# Altium schematic sheet GPIO_M1.SchDoc
size A4
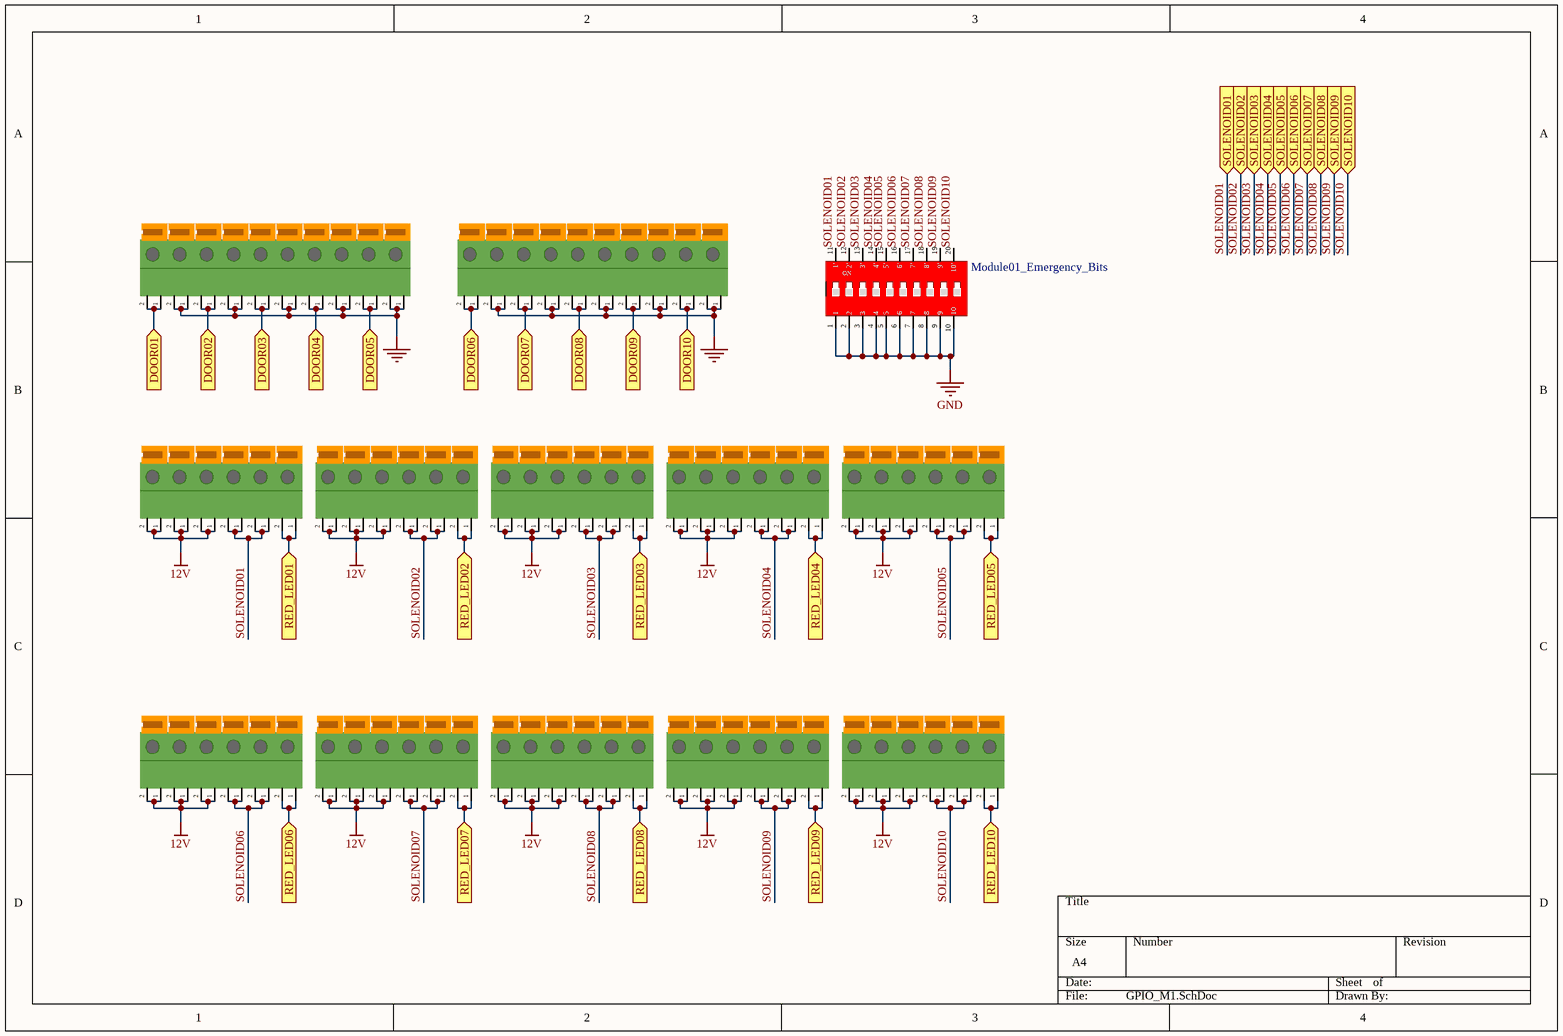
[diagram p0: GPIO_M1.SchDoc]

## Parts
*1  D01  [5#Terminalx1]  (value not drawn)
*2  D06  [5#Terminalx1]  (value not drawn)
*3  GND  [5#Terminalx1]  (value not drawn)
*4  GND  [5#Terminalx1]  (value not drawn)
*5  D02  [5#Terminalx1]  (value not drawn)
*6  D07  [5#Terminalx1]  (value not drawn)
*7  GND  [5#Terminalx1]  (value not drawn)
*8  GND  [5#Terminalx1]  (value not drawn)
*9  D03  [5#Terminalx1]  (value not drawn)
*10  D08  [5#Terminalx1]  (value not drawn)
*11  GND  [5#Terminalx1]  (value not drawn)
*12  GND  [5#Terminalx1]  (value not drawn)
*13  D04  [5#Terminalx1]  (value not drawn)
*14  D09  [5#Terminalx1]  (value not drawn)
*15  GND  [5#Terminalx1]  (value not drawn)
*16  GND  [5#Terminalx1]  (value not drawn)
*17  D05  [5#Terminalx1]  (value not drawn)
*18  D10  [5#Terminalx1]  (value not drawn)
*19  GND  [5#Terminalx1]  (value not drawn)
*20  GND  [5#Terminalx1]  (value not drawn)
*21  12V  [5#Terminalx1]  (value not drawn)
*22  12V  [5#Terminalx1]  (value not drawn)
*23  12V  [5#Terminalx1]  (value not drawn)
*24  12V  [5#Terminalx1]  (value not drawn)
*25  12V  [5#Terminalx1]  (value not drawn)
*26  12V  [5#Terminalx1]  (value not drawn)
*27  S01  [5#Terminalx1]  (value not drawn)
*28  S06  [5#Terminalx1]  (value not drawn)
*29  G01  [5#Terminalx1]  (value not drawn)
*30  G06  [5#Terminalx1]  (value not drawn)
*31  R01  [5#Terminalx1]  (value not drawn)
*32  R06  [5#Terminalx1]  (value not drawn)
*33  12V  [5#Terminalx1]  (value not drawn)
*34  12V  [5#Terminalx1]  (value not drawn)
*35  12V  [5#Terminalx1]  (value not drawn)
*36  12V  [5#Terminalx1]  (value not drawn)
*37  12V  [5#Terminalx1]  (value not drawn)
*38  12V  [5#Terminalx1]  (value not drawn)
*39  S02  [5#Terminalx1]  (value not drawn)
*40  S07  [5#Terminalx1]  (value not drawn)
*41  G02  [5#Terminalx1]  (value not drawn)
*42  G07  [5#Terminalx1]  (value not drawn)
*43  R02  [5#Terminalx1]  (value not drawn)
*44  R07  [5#Terminalx1]  (value not drawn)
*45  12V  [5#Terminalx1]  (value not drawn)
*46  12V  [5#Terminalx1]  (value not drawn)
*47  12V  [5#Terminalx1]  (value not drawn)
*48  12V  [5#Terminalx1]  (value not drawn)
*49  12V  [5#Terminalx1]  (value not drawn)
*50  12V  [5#Terminalx1]  (value not drawn)
*51  S03  [5#Terminalx1]  (value not drawn)
*52  S08  [5#Terminalx1]  (value not drawn)
*53  G03  [5#Terminalx1]  (value not drawn)
*54  G08  [5#Terminalx1]  (value not drawn)
*55  R03  [5#Terminalx1]  (value not drawn)
*56  R08  [5#Terminalx1]  (value not drawn)
*57  12V  [5#Terminalx1]  (value not drawn)
*58  12V  [5#Terminalx1]  (value not drawn)
*59  12V  [5#Terminalx1]  (value not drawn)
*60  12V  [5#Terminalx1]  (value not drawn)
*61  12V  [5#Terminalx1]  (value not drawn)
*62  12V  [5#Terminalx1]  (value not drawn)
*63  S04  [5#Terminalx1]  (value not drawn)
*64  S09  [5#Terminalx1]  (value not drawn)
*65  G04  [5#Terminalx1]  (value not drawn)
*66  G09  [5#Terminalx1]  (value not drawn)
*67  R04  [5#Terminalx1]  (value not drawn)
*68  R09  [5#Terminalx1]  (value not drawn)
*69  12V  [5#Terminalx1]  (value not drawn)
*70  12V  [5#Terminalx1]  (value not drawn)
*71  12V  [5#Terminalx1]  (value not drawn)
*72  12V  [5#Terminalx1]  (value not drawn)
*73  12V  [5#Terminalx1]  (value not drawn)
*74  12V  [5#Terminalx1]  (value not drawn)
*75  S05  [5#Terminalx1]  (value not drawn)
*76  S10  [5#Terminalx1]  (value not drawn)
*77  G05  [5#Terminalx1]  (value not drawn)
*78  G10  [5#Terminalx1]  (value not drawn)
*79  R05  [5#Terminalx1]  (value not drawn)
*80  R10  [5#Terminalx1]  (value not drawn)
Bit1  Module01_Emergency_Bits  [6#Bit_Switch_10]

## Ports
DOOR01 (in), DOOR02 (in), DOOR03 (in), DOOR04 (in), DOOR05 (in), DOOR06 (in), DOOR07 (in), DOOR08 (in), DOOR09 (in), DOOR10 (in), RED_LED01 (in), RED_LED02 (in), RED_LED03 (in), RED_LED04 (in), RED_LED05 (in), RED_LED06 (in), RED_LED07 (in), RED_LED08 (in), RED_LED09 (in), RED_LED10 (in), SOLENOID01 (in), SOLENOID02 (in), SOLENOID03 (in), SOLENOID04 (in), SOLENOID05 (in), SOLENOID06 (in), SOLENOID07 (in), SOLENOID08 (in), SOLENOID09 (in), SOLENOID10 (in)

## Nets
12V: *21.1 *21.2 *22.1 *22.2 *23.1 *23.2 *24.1 *24.2 *25.1 *25.2 *26.1 *26.2 *33.1 *33.2 *34.1 *34.2 *35.1 *35.2 *36.1 *36.2 *37.1 *37.2 *38.1 *38.2 *45.1 *45.2 *46.1 *46.2 *47.1 *47.2 *48.1 *48.2 *49.1 *49.2 *50.1 *50.2 *57.1 *57.2 *58.1 *58.2 *59.1 *59.2 *60.1 *60.2 *61.1 *61.2 *62.1 *62.2 *69.1 *69.2 *70.1 *70.2 *71.1 *71.2 *72.1 *72.2 *73.1 *73.2 *74.1 *74.2
GND: *3.1 *3.2 *4.1 *4.2 *7.1 *7.2 *8.1 *8.2 *11.1 *11.2 *12.1 *12.2 *15.1 *15.2 *16.1 *16.2 *19.1 *19.2 *20.1 *20.2 Bit1.1 Bit1.2 Bit1.3 Bit1.4 Bit1.5 Bit1.6 Bit1.7 Bit1.8 Bit1.9 Bit1.10
DOOR01: *1.1 *1.2 ; port DOOR01
DOOR02: *5.1 *5.2 ; port DOOR02
DOOR03: *9.1 *9.2 ; port DOOR03
DOOR04: *13.1 *13.2 ; port DOOR04
DOOR05: *17.1 *17.2 ; port DOOR05
DOOR06: *2.1 *2.2 ; port DOOR06
DOOR07: *6.1 *6.2 ; port DOOR07
DOOR08: *10.1 *10.2 ; port DOOR08
DOOR09: *14.1 *14.2 ; port DOOR09
DOOR10: *18.1 *18.2 ; port DOOR10
RED_LED01: *31.1 *31.2 ; port RED_LED01
RED_LED02: *43.1 *43.2 ; port RED_LED02
RED_LED03: *55.1 *55.2 ; port RED_LED03
RED_LED04: *67.1 *67.2 ; port RED_LED04
RED_LED05: *79.1 *79.2 ; port RED_LED05
RED_LED06: *32.1 *32.2 ; port RED_LED06
RED_LED07: *44.1 *44.2 ; port RED_LED07
RED_LED08: *56.1 *56.2 ; port RED_LED08
RED_LED09: *68.1 *68.2 ; port RED_LED09
RED_LED10: *80.1 *80.2 ; port RED_LED10
SOLENOID01: *27.1 *27.2 *29.1 *29.2 Bit1.11(1') ; port SOLENOID01
SOLENOID02: *39.1 *39.2 *41.1 *41.2 Bit1.12(2') ; port SOLENOID02
SOLENOID03: *51.1 *51.2 *53.1 *53.2 Bit1.13(3') ; port SOLENOID03
SOLENOID04: *63.1 *63.2 *65.1 *65.2 Bit1.14(4') ; port SOLENOID04
SOLENOID05: *75.1 *75.2 *77.1 *77.2 Bit1.15(5') ; port SOLENOID05
SOLENOID06: *28.1 *28.2 *30.1 *30.2 Bit1.16(6') ; port SOLENOID06
SOLENOID07: *40.1 *40.2 *42.1 *42.2 Bit1.17(7') ; port SOLENOID07
SOLENOID08: *52.1 *52.2 *54.1 *54.2 Bit1.18(8') ; port SOLENOID08
SOLENOID09: *64.1 *64.2 *66.1 *66.2 Bit1.19(9') ; port SOLENOID09
SOLENOID10: *76.1 *76.2 *78.1 *78.2 Bit1.20(10') ; port SOLENOID10

## Notes on the sheet
- (in symbol 6#Bit_Switch_10) ON

## Library data of the parts
*1-*80 = 5#Terminalx1
Bit1 = 6#Bit_Switch_10